# EAGLE design CncBooster_1.1 (EAGLE 7.2.0)
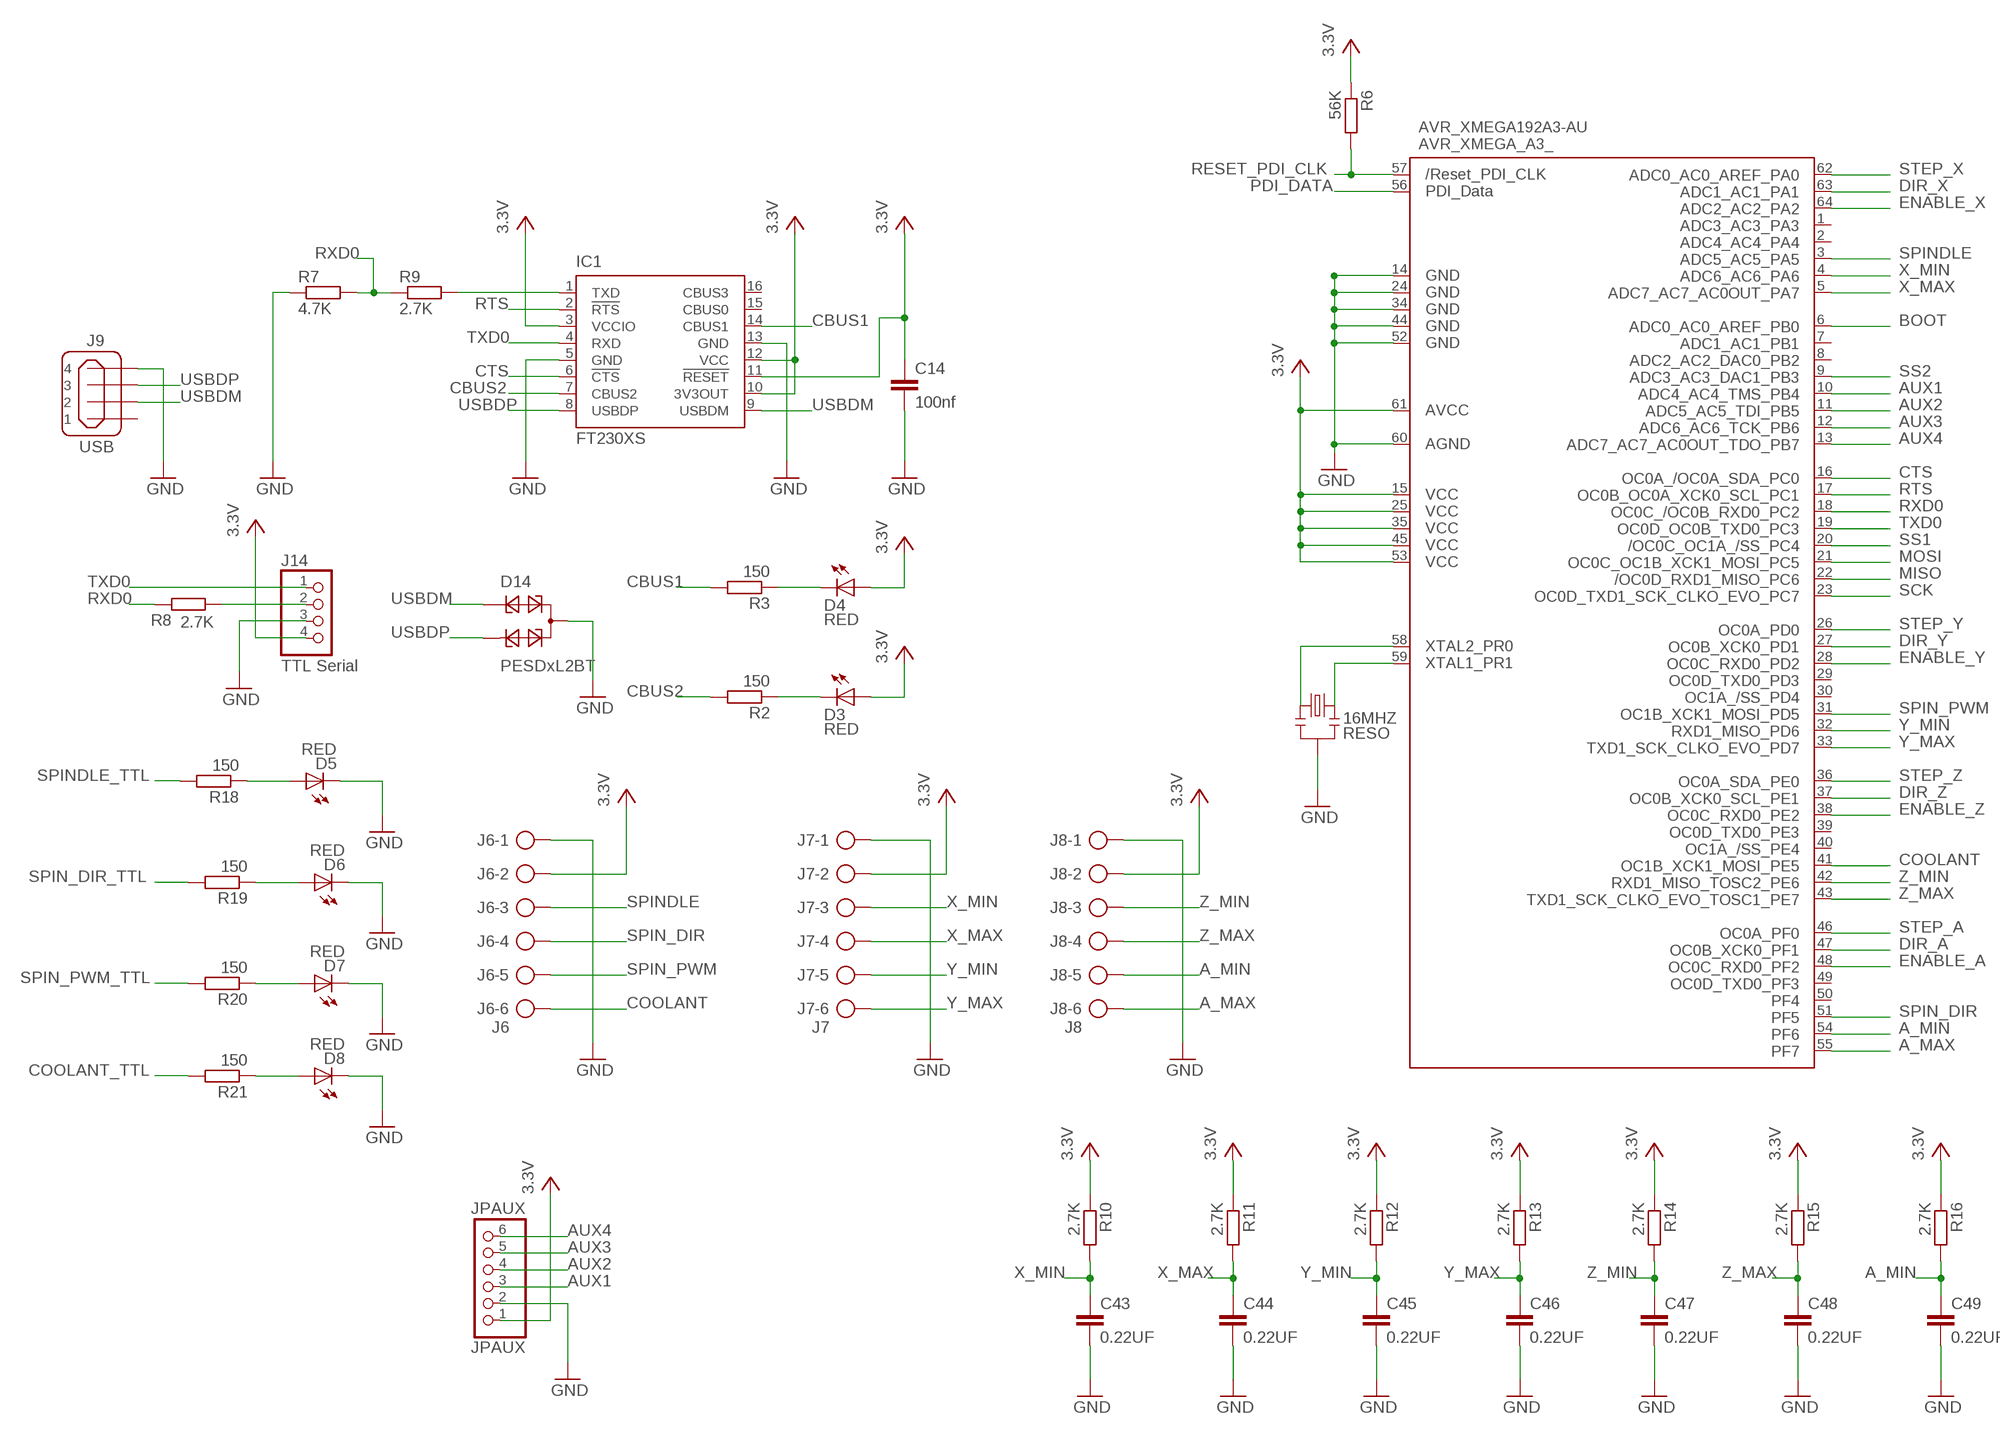
[diagram p0: schematic, sheet 1, part 1 of 2]
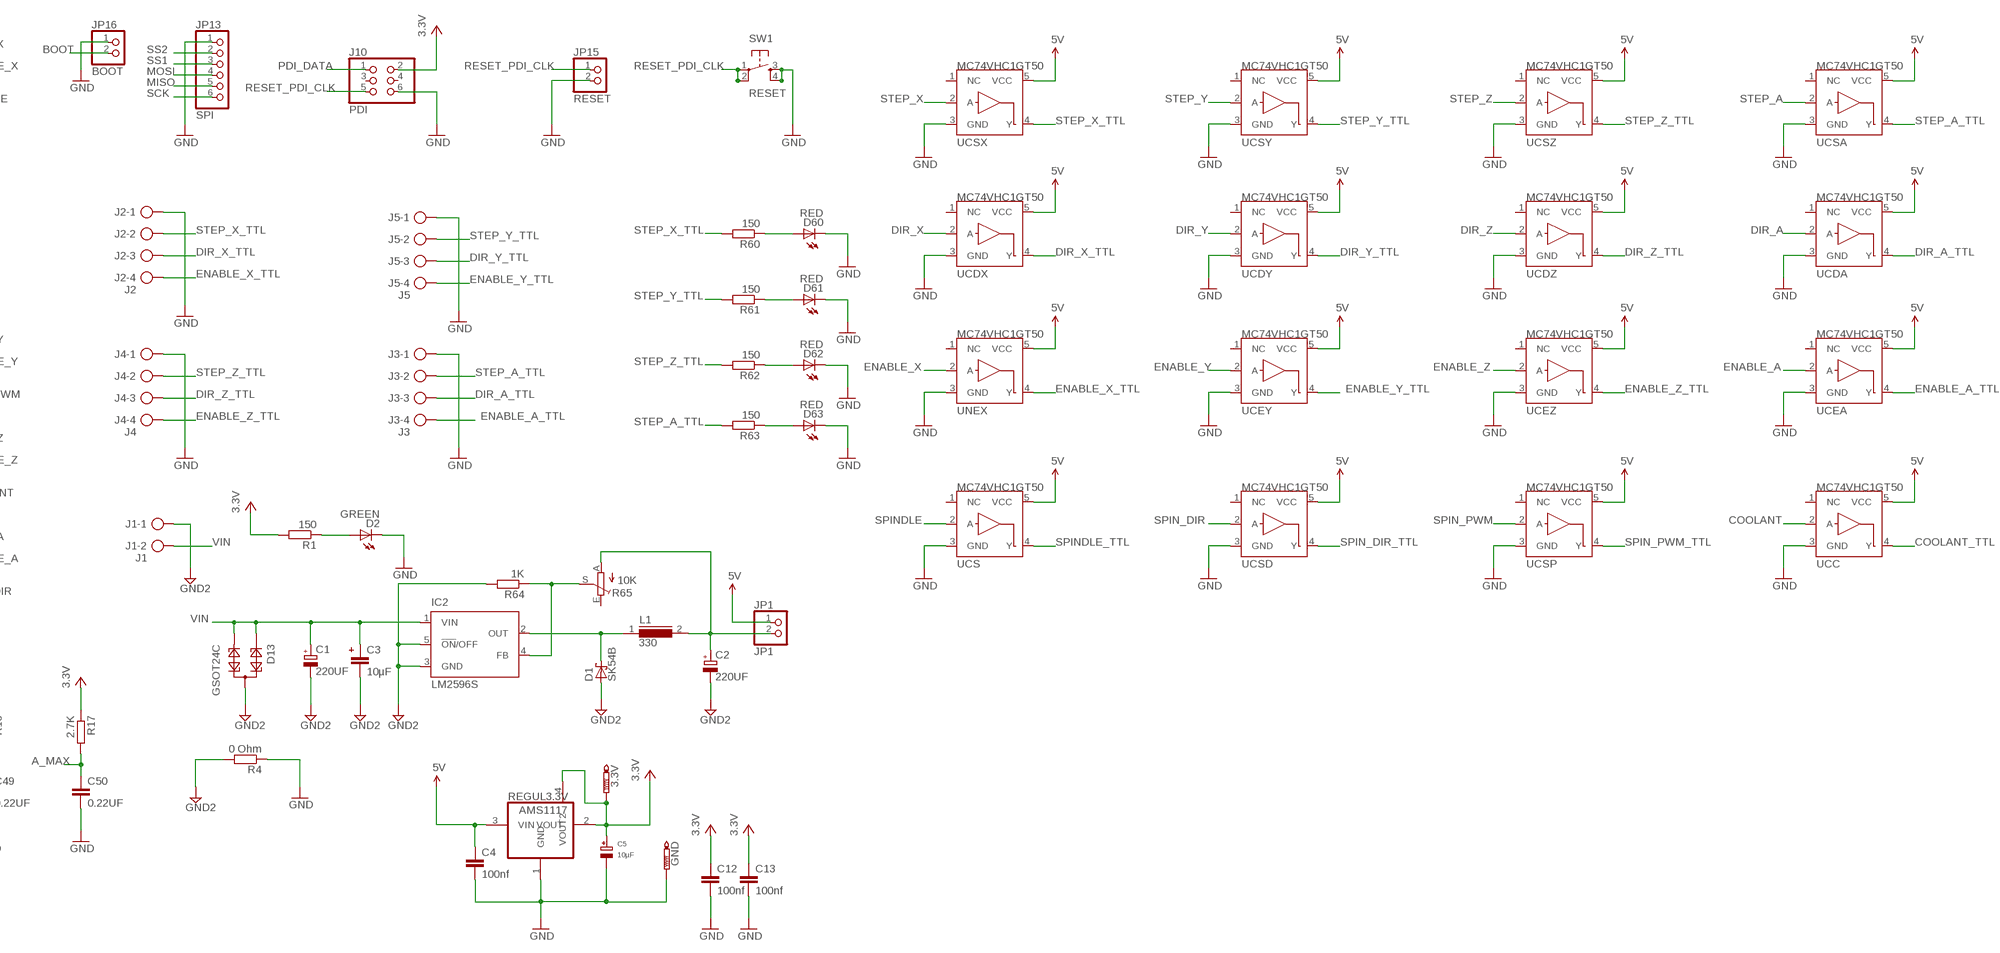
[diagram p1: schematic, sheet 1, part 2 of 2]

## Parts
3.3V  PTR1B1,27  [B1,27]
16MHZ  RESO  RESONATOR_CMS  [RESONATOR_CMS_AWSCR]
AVR_XMEGA192A3-AU  AVR_XMEGA_A3_  [TQFP64]
C1  220UF  CPOL-EUE  [PANASONIC_E]
C2  220UF  CPOL-EUE  [PANASONIC_E]
C3  10µF  CONDO_1206_POLA  [CONDO_1206]
C4  100nf  C-EUC1206  [C1206]
C5  10µF  CAP_TANTALUMA/3216_WAVE  [EIA3216-18/A-W]
C12  100nf  C-EUC1206  [C1206]
C13  100nf  C-EUC1206  [C1206]
C14  100nf  C-EUC1206  [C1206]
C43  0.22UF  C-EUC1206  [C1206]
C44  0.22UF  C-EUC1206  [C1206]
C45  0.22UF  C-EUC1206  [C1206]
C46  0.22UF  C-EUC1206  [C1206]
C47  0.22UF  C-EUC1206  [C1206]
C48  0.22UF  C-EUC1206  [C1206]
C49  0.22UF  C-EUC1206  [C1206]
C50  0.22UF  C-EUC1206  [C1206]
D1  SK54B  [DO-214AA]
D2  GREEN  LEDCHIPLED_1206  [CHIPLED_1206]
D3  RED  LEDCHIPLED_1206  [CHIPLED_1206]
D4  RED  LEDCHIPLED_1206  [CHIPLED_1206]
D5  RED  LEDCHIPLED_1206  [CHIPLED_1206]
D6  RED  LEDCHIPLED_1206  [CHIPLED_1206]
D7  RED  LEDCHIPLED_1206  [CHIPLED_1206]
D8  RED  LEDCHIPLED_1206  [CHIPLED_1206]
D13  GSOT24C  PESD1CAN  [SOT23]
D14  PESDxL2BT  PESD1CAN  [SOT23]
D60  RED  LEDCHIPLED_1206  [CHIPLED_1206]
D61  RED  LEDCHIPLED_1206  [CHIPLED_1206]
D62  RED  LEDCHIPLED_1206  [CHIPLED_1206]
D63  RED  LEDCHIPLED_1206  [CHIPLED_1206]
GND  PTR1B1,27  [B1,27]
IC1  FT230XS  [SSOP16]
IC2  LM2596S  [TO263-5]
J1  J1  AK500/2  [AK500/2]
J2  J2  AK500/4  [AK500/4]
J3  J3  AK500/4  [AK500/4]
J4  J4  AK500/4  [AK500/4]
J5  J5  AK500/4  [AK500/4]
J6  J6  AK500/6  [AK500/6]
J7  J7  AK500/6  [AK500/6]
J8  J8  AK500/6  [AK500/6]
J9  USB  MINI-USB_4P-85-32004-10X  [85-32004-10X]
J10  PDI  PINHD-2X3  [2X03]
J14  TTL Serial  PINHD-1X4  [1X04]
JP1  JP1  PINHD-1X2  [1X02]
JP13  SPI  PINHD-1X6  [1X06]
JP15  RESET  PINHD-1X2  [1X02]
JP16  BOOT  PINHD-1X2  [1X02]
JPAUX  JPAUX  PINHD-1X6  [1X06]
L1  330  DR127  [DR127]
R1  150  R-EU_R1206  [R1206]
R2  150  R-EU_R1206  [R1206]
R3  150  R-EU_R1206  [R1206]
R4  0 Ohm  R-EU_R1206  [R1206]
R6  56K  R-EU_R1206  [R1206]
R7  4.7K  R-EU_R1206  [R1206]
R8  2.7K  R-EU_R1206  [R1206]
R9  2.7K  R-EU_R1206  [R1206]
R10  2.7K  R-EU_R1206  [R1206]
R11  2.7K  R-EU_R1206  [R1206]
R12  2.7K  R-EU_R1206  [R1206]
R13  2.7K  R-EU_R1206  [R1206]
R14  2.7K  R-EU_R1206  [R1206]
R15  2.7K  R-EU_R1206  [R1206]
R16  2.7K  R-EU_R1206  [R1206]
R17  2.7K  R-EU_R1206  [R1206]
R18  150  R-EU_R1206  [R1206]
R19  150  R-EU_R1206  [R1206]
R20  150  R-EU_R1206  [R1206]
R21  150  R-EU_R1206  [R1206]
R60  150  R-EU_R1206  [R1206]
R61  150  R-EU_R1206  [R1206]
R62  150  R-EU_R1206  [R1206]
R63  150  R-EU_R1206  [R1206]
R64  1K  R-EU_R1206  [R1206]
R65  10K  TRIM_EU-S64W  [S64W]
REGUL3.3V  AMS1117  [SOT223-A]
SW1  RESET  TAC_SWITCHSMD  [TACTILE_SWITCH_SMD]
UCC  MC74VHC1GT50  [SOT23-5]
UCDA  MC74VHC1GT50  [SOT23-5]
UCDX  MC74VHC1GT50  [SOT23-5]
UCDY  MC74VHC1GT50  [SOT23-5]
UCDZ  MC74VHC1GT50  [SOT23-5]
UCEA  MC74VHC1GT50  [SOT23-5]
UCEY  MC74VHC1GT50  [SOT23-5]
UCEZ  MC74VHC1GT50  [SOT23-5]
UCS  MC74VHC1GT50  [SOT23-5]
UCSA  MC74VHC1GT50  [SOT23-5]
UCSD  MC74VHC1GT50  [SOT23-5]
UCSP  MC74VHC1GT50  [SOT23-5]
UCSX  MC74VHC1GT50  [SOT23-5]
UCSY  MC74VHC1GT50  [SOT23-5]
UCSZ  MC74VHC1GT50  [SOT23-5]
UNEX  MC74VHC1GT50  [SOT23-5]

## Nets
5V: C4.1 JP1.1 REGUL3.3V.3(VIN) UCC.5(VCC) UCDA.5(VCC) UCDX.5(VCC) UCDY.5(VCC) UCDZ.5(VCC) UCEA.5(VCC) UCEY.5(VCC) UCEZ.5(VCC) UCS.5(VCC) UCSA.5(VCC) UCSD.5(VCC) UCSP.5(VCC) UCSX.5(VCC) UCSY.5(VCC) UCSZ.5(VCC) UNEX.5(VCC)
A_MAX: AVR_XMEGA192A3-AU.55(PF7) C50.1 J8.6 R17.2
A_MIN: AVR_XMEGA192A3-AU.54(PF6) C49.1 J8.5 R16.2
AUX1: AVR_XMEGA192A3-AU.10(PB4) JPAUX.3
AUX2: AVR_XMEGA192A3-AU.11(PB5) JPAUX.4
AUX3: AVR_XMEGA192A3-AU.12(PB6) JPAUX.5
AUX4: AVR_XMEGA192A3-AU.13(PB7) JPAUX.6
BOOT: AVR_XMEGA192A3-AU.6(PB0) JP16.2
CBUS1: IC1.14(CBUS1) R3.2
CBUS2: IC1.7(CBUS2) R2.2
COOLANT: AVR_XMEGA192A3-AU.41(PE5) J6.6 UCC.2(A)
COOLANT_TTL: R21.2 UCC.4(Y)
CTS: AVR_XMEGA192A3-AU.16(PC0) IC1.6(!CTS)
DIR_A: AVR_XMEGA192A3-AU.47(PF1) UCDA.2(A)
DIR_A_TTL: J3.3 UCDA.4(Y)
DIR_X: AVR_XMEGA192A3-AU.63(PA1) UCDX.2(A)
DIR_X_TTL: J2.3 UCDX.4(Y)
DIR_Y: AVR_XMEGA192A3-AU.27(PD1) UCDY.2(A)
DIR_Y_TTL: J5.3 UCDY.4(Y)
DIR_Z: AVR_XMEGA192A3-AU.37(PE1) UCDZ.2(A)
DIR_Z_TTL: J4.3 UCDZ.4(Y)
ENABLE_A: AVR_XMEGA192A3-AU.48(PF2) UCEA.2(A)
ENABLE_A_TTL: J3.4 UCEA.4(Y)
ENABLE_X: AVR_XMEGA192A3-AU.64(PA2) UNEX.2(A)
ENABLE_X_TTL: J2.4 UNEX.4(Y)
ENABLE_Y: AVR_XMEGA192A3-AU.28(PD2) UCEY.2(A)
ENABLE_Y_TTL: J5.4 UCEY.4(Y)
ENABLE_Z: AVR_XMEGA192A3-AU.38(PE2) UCEZ.2(A)
ENABLE_Z_TTL: J4.4 UCEZ.4(Y)
GND: 16MHZ.P$3 AVR_XMEGA192A3-AU.14(GND1) AVR_XMEGA192A3-AU.24(GND2) AVR_XMEGA192A3-AU.34(GND3) AVR_XMEGA192A3-AU.44(GND4) AVR_XMEGA192A3-AU.52(GND5) AVR_XMEGA192A3-AU.60(AGND) C4.2 C5.- C12.2 C13.2 C14.2 C43.2 C44.2 C45.2 C46.2 C47.2 C48.2 C49.2 C50.2 D2.C D5.C D6.C D7.C D8.C D14.3 D60.C D61.C D62.C D63.C GND.TP IC1.5(GND) IC1.13(GND) J2.1 J3.1 J4.1 J5.1 J6.1 J7.1 J8.1 J9.4 J10.6 J14.3 JP13.1 JP15.2 JP16.1 JPAUX.2 R4.1 R7.1 REGUL3.3V.1(GND) SW1.3 SW1.4 UCC.3(GND) UCDA.3(GND) UCDX.3(GND) UCDY.3(GND) UCDZ.3(GND) UCEA.3(GND) UCEY.3(GND) UCEZ.3(GND) UCS.3(GND) UCSA.3(GND) UCSD.3(GND) UCSP.3(GND) UCSX.3(GND) UCSY.3(GND) UCSZ.3(GND) UNEX.3(GND)
GND2 [Power]: C1.- C2.- C3.1 D1.A D13.3 IC2.3(GND) IC2.5(!ON!/OFF) J1.1 R4.2 R64.2
MISO: AVR_XMEGA192A3-AU.22(PC6) JP13.5
MOSI: AVR_XMEGA192A3-AU.21(PC5) JP13.4
N$1: 16MHZ.P$2 AVR_XMEGA192A3-AU.59(PR1)
N$2: 16MHZ.P$1 AVR_XMEGA192A3-AU.58(PR0)
N$3: D3.C R2.1
N$4: D4.C R3.1
N$5: J14.2 R8.1
N$6: IC1.1(TXD) R9.2
N$7: D5.A R18.1
N$8: D6.A R19.1
N$9: D7.A R20.1
N$10: D8.A R21.1
N$11: D60.A R60.1
N$12: D61.A R61.1
N$13: D62.A R62.1
N$14: D63.A R63.1
N$15 [Power]: D1.C IC2.2(OUT) L1.1
N$16 [Power]: IC2.4(FB) R64.1 R65.S
N$17: D2.A R1.1
N$18 [Power]: C2.+ JP1.2 L1.2 R65.A
PDI_DATA: AVR_XMEGA192A3-AU.56(PDI_DATA) J10.1
RESET_PDI_CLK: AVR_XMEGA192A3-AU.57(RESET) J10.5 JP15.1 R6.2 SW1.1 SW1.2
RTS: AVR_XMEGA192A3-AU.17(PC1) IC1.2(!RTS)
RXD0: AVR_XMEGA192A3-AU.18(PC2) R7.2 R8.2 R9.1
SCK: AVR_XMEGA192A3-AU.23(PC7) JP13.6
SPIN_DIR: AVR_XMEGA192A3-AU.51(PF5) J6.4 UCSD.2(A)
SPIN_DIR_TTL: R19.2 UCSD.4(Y)
SPIN_PWM: AVR_XMEGA192A3-AU.31(PD5) J6.5 UCSP.2(A)
SPIN_PWM_TTL: R20.2 UCSP.4(Y)
SPINDLE: AVR_XMEGA192A3-AU.3(PA5) J6.3 UCS.2(A)
SPINDLE_TTL: R18.2 UCS.4(Y)
SS1: AVR_XMEGA192A3-AU.20(PC4) JP13.3
SS2: AVR_XMEGA192A3-AU.9(PB3) JP13.2
STEP_A: AVR_XMEGA192A3-AU.46(PF0) UCSA.2(A)
STEP_A_TTL: J3.2 R63.2 UCSA.4(Y)
STEP_X: AVR_XMEGA192A3-AU.62(PA0) UCSX.2(A)
STEP_X_TTL: J2.2 R60.2 UCSX.4(Y)
STEP_Y: AVR_XMEGA192A3-AU.26(PD0) UCSY.2(A)
STEP_Y_TTL: J5.2 R61.2 UCSY.4(Y)
STEP_Z: AVR_XMEGA192A3-AU.36(PE0) UCSZ.2(A)
STEP_Z_TTL: J4.2 R62.2 UCSZ.4(Y)
TXD0: AVR_XMEGA192A3-AU.19(PC3) IC1.4(RXD) J14.1
USBDM: D14.1 IC1.9(USBDM) J9.2
USBDP: D14.2 IC1.8(USBDP) J9.3
VCC: 3.3V.TP AVR_XMEGA192A3-AU.15(VCC1) AVR_XMEGA192A3-AU.25(VCC2) AVR_XMEGA192A3-AU.35(VCC3) AVR_XMEGA192A3-AU.45(VCC4) AVR_XMEGA192A3-AU.53(VCC5) AVR_XMEGA192A3-AU.61(AVCC) C5.+ C12.1 C13.1 C14.1 D3.A D4.A IC1.3(VCCIO) IC1.10(3V3OUT) IC1.11(!RESET) IC1.12(VCC) J6.2 J7.2 J8.2 J10.2 J14.4 JPAUX.1 R1.2 R6.1 R10.1 R11.1 R12.1 R13.1 R14.1 R15.1 R16.1 R17.1 REGUL3.3V.2(VOUT) REGUL3.3V.4(VOUT2) ; supply symbol labelled 3.3V
VIN [Power]: C1.+ C3.2 D13.1 D13.2 IC2.1(VIN) J1.2
X_MAX: AVR_XMEGA192A3-AU.5(PA7) C44.1 J7.4 R11.2
X_MIN: AVR_XMEGA192A3-AU.4(PA6) C43.1 J7.3 R10.2
Y_MAX: AVR_XMEGA192A3-AU.33(PD7) C46.1 J7.6 R13.2
Y_MIN: AVR_XMEGA192A3-AU.32(PD6) C45.1 J7.5 R12.2
Z_MAX: AVR_XMEGA192A3-AU.43(PE7) C48.1 J8.4 R15.2
Z_MIN: AVR_XMEGA192A3-AU.42(PE6) C47.1 J8.3 R14.2
Unconnected: AVR_XMEGA192A3-AU.1(PA3) AVR_XMEGA192A3-AU.2(PA4) AVR_XMEGA192A3-AU.7(PB1) AVR_XMEGA192A3-AU.8(PB2) AVR_XMEGA192A3-AU.29(PD3) AVR_XMEGA192A3-AU.30(PD4) AVR_XMEGA192A3-AU.39(PE3) AVR_XMEGA192A3-AU.40(PE4) AVR_XMEGA192A3-AU.49(PF3) AVR_XMEGA192A3-AU.50(PF4) IC1.15(CBUS0) IC1.16(CBUS3) J9.1 J10.3 J10.4 R65.E UCC.1(NC) UCDA.1(NC) UCDX.1(NC) UCDY.1(NC) UCDZ.1(NC) UCEA.1(NC) UCEY.1(NC) UCEZ.1(NC) UCS.1(NC) UCSA.1(NC) UCSD.1(NC) UCSP.1(NC) UCSX.1(NC) UCSY.1(NC) UCSZ.1(NC) UNEX.1(NC)

## Library data of the parts
3.3V GND = testpad:PTR1: TEST PIN
16MHZ = QuartzCeramiqueCMS:RESONATOR_CMS
AVR_XMEGA192A3-AU = xmega:AVR_XMEGA_A3_: Device for Atmel AVR XMEGA A3 Series
C1 C2 = resistor:CPOL-EU: POLARIZED CAPACITOR, European symbol
C3 = Base_CC:CONDO_1206_POLA
C4 C12-C14 C43-C50 = rcl:C-EU: CAPACITOR, European symbol
C5 = microbuilder:CAP_TANTALUM: Tantalum Capacitors Wave footprints have larger pads and are meant to be used for hand soldering. Reflow footprints are optimised for solder paste and a reflow oven. EIA3216-18/A-[R/W] - Size A / 3216-18 / 1206 footprint 4.7µF 25V 10% Tantalum Capacitor 10µF 16V 10% Tantalum Capacitor [Digikey: 495-2236-2-ND] EIA3528-21/B-[R/W] - Size B / 3528-21 47µF 10V 10% Tantalum Capactior [Digikey: 495-2216-1-ND] EIA6032-28/C-[R/W] - Size C / 6032-28 10µF 35V 20% Tantalum Capacitor [Digikey: 495-2285-1-ND] 100µF 16V 10% Tantalum Capactior [Digikey: 399-5214-1-ND]
D1 = GlowATof:SK54B
D2-D8 D60-D63 = Base_CC:LED: LED OSRAM: - CHIPLED LG R971, LG N971, LY N971, LG Q971, LY Q971, LO R971, LY R971 LH N974, LH R974 LS Q976, LO Q976, LY Q976 LO Q996 - Hyper CHIPLED LW Q18S LB Q993, LB Q99A, LB R99A - SideLED LS A670, LO A670, LY A670, LG A670, LP A670 LB A673, LV A673, LT A673, LW A673 LH A674 LY A675 LS A676, LA A676, LO A676, LY A676, LW A676 LS A679, LY A679, LG A679 - Hyper Micro SIDELED® LS Y876, LA Y876, LO Y876, LY Y876 LT Y87S - SmartLED LW L88C, LW L88S LB L89C, LB L89S, LG L890 LS L89K, LO L89K, LY L89K LS L896, LA L896, LO L896, LY L896 - TOPLED LS T670, LO T670, LY T670, LG T670, LP T670 LSG T670, LSP T670, LSY T670, LOP T670, LYG T670 LG T671, LOG T671, LSG T671 LB T673, LV T673, LT T673, LW T673 LH T674 LS T676, LA T676, LO T676, LY T676, LB T676, LH T676, LSB T676, LW T676 LB T67C, LV T67C, LT T67C, LS T67K, LO T67K, LY T67K, LW E67C LS E67B, LA E67B, LO E67B, LY E67B, LB E67C, LV E67C, LT E67C LW T67C LS T679, LY T679, LG T679 LS T770, LO T770, LY T770, LG T770, LP T770 LB T773, LV T773, LT T773, LW T773 LH T774 LS E675, LA E675, LY E675, LS T675 LS T776, LA T776, LO T776, LY T776, LB T776 LHGB T686 LT T68C, LB T68C - Hyper Mini TOPLED® LB M676 - Mini TOPLED Santana® LG M470 LS M47K, LO M47K, LY M47K Source: http://www.osram.convergy.de LUXEON: - LUMILED® LXK2-PW12-R00, LXK2-PW12-S00, LXK2-PW14-U00, LXK2-PW14-V00 LXK2-PM12-R00, LXK2-PM12-S00, LXK2-PM14-U00 LXK2-PE12-Q00, LXK2-PE12-R00, LXK2-PE12-S00, LXK2-PE14-T00, LXK2-PE14-U00 LXK2-PB12-K00, LXK2-PB12-L00, LXK2-PB12-M00, LXK2-PB14-N00, LXK2-PB14-P00, LXK2-PB14-Q00 LXK2-PR12-L00, LXK2-PR12-M00, LXK2-PR14-Q00, LXK2-PR14-R00 LXK2-PD12-Q00, LXK2-PD12-R00, LXK2-PD12-S00 LXK2-PH12-R00, LXK2-PH12-S00 LXK2-PL12-P00, LXK2-PL12-Q00, LXK2-PL12-R00 Source: www.luxeon.com KINGBRIGHT: KA-3528ASYC Source: www.kingbright.com
D13 D14 = diode:PESD1CAN: CAN bus ESD protection diode Source: http://www.nxp.com/documents/data_sheet/PESD1CAN.pdf
IC1 = ftdichip:FT230X: USB to BASIC UART IC Auto generated by make-symbol-device-package-bsdl.ulp Rev. 43 Source: Data sheet <http://www.ftdichip.com/Support/Documents/DataSheets/ICs/DS_FT230X.pdf>
IC2 = national-semiconductor:LM2596: SIMPLE SWITCHER® Power Converter 150 kHz 3A Step-Down Voltage Regulator Source: http://www.national.com/ds/LM/LM2596.pdf; MF: NATIONAL SEMICONDUCTOR; MPN: LM2596S-ADJ/NOPB; OC_FARNELL: 9494367; OC_NEWARK: 41K3842
J1 = con-ptr500:AK500/2: CONNECTOR; OC_FARNELL: unknown; OC_NEWARK: unknown
J2-J5 = con-ptr500:AK500/4: CONNECTOR; OC_FARNELL: unknown; OC_NEWARK: unknown
J6-J8 = con-ptr500:AK500/6: CONNECTOR; OC_FARNELL: unknown; OC_NEWARK: unknown
J9 = con-cypressindustries:MINI-USB_4P-: MINI USB 4 Pol. Source: www.cypressindustries.com
J10 = pinhead:PINHD-2X3: PIN HEADER
J14 = pinhead:PINHD-1X4: PIN HEADER
JP1 JP15 JP16 = pinhead:PINHD-1X2: PIN HEADER
JP13 JPAUX = pinhead:PINHD-1X6: PIN HEADER
L1 = inductors:DR127: High Power Density, High Efficiency, Shielded Inductors Source: coiltronics_dr_series.pdf
R1-R4 R6-R21 R60-R64 = Base_CC:R-EU_: RESISTOR, European symbol
R65 = pot:TRIM_EU-: POTENTIOMETER
REGUL3.3V = CC_burr-brown:AMS1117
SW1 = SparkFun:TAC_SWITCH: Momentary Switch Button commonly used for reset or general input. Spark Fun Electronics SKU : COM-00097
UCC UCDA UCDX UCDY UCDZ UCEA UCEY UCEZ UCS UCSA UCSD UCSP UCSX UCSY UCSZ UNEX = SparkFun3:MC74VHC1GT50

## Net classes
0 default: width 0.406 mm
1 Power: width 0.762 mm

## Board
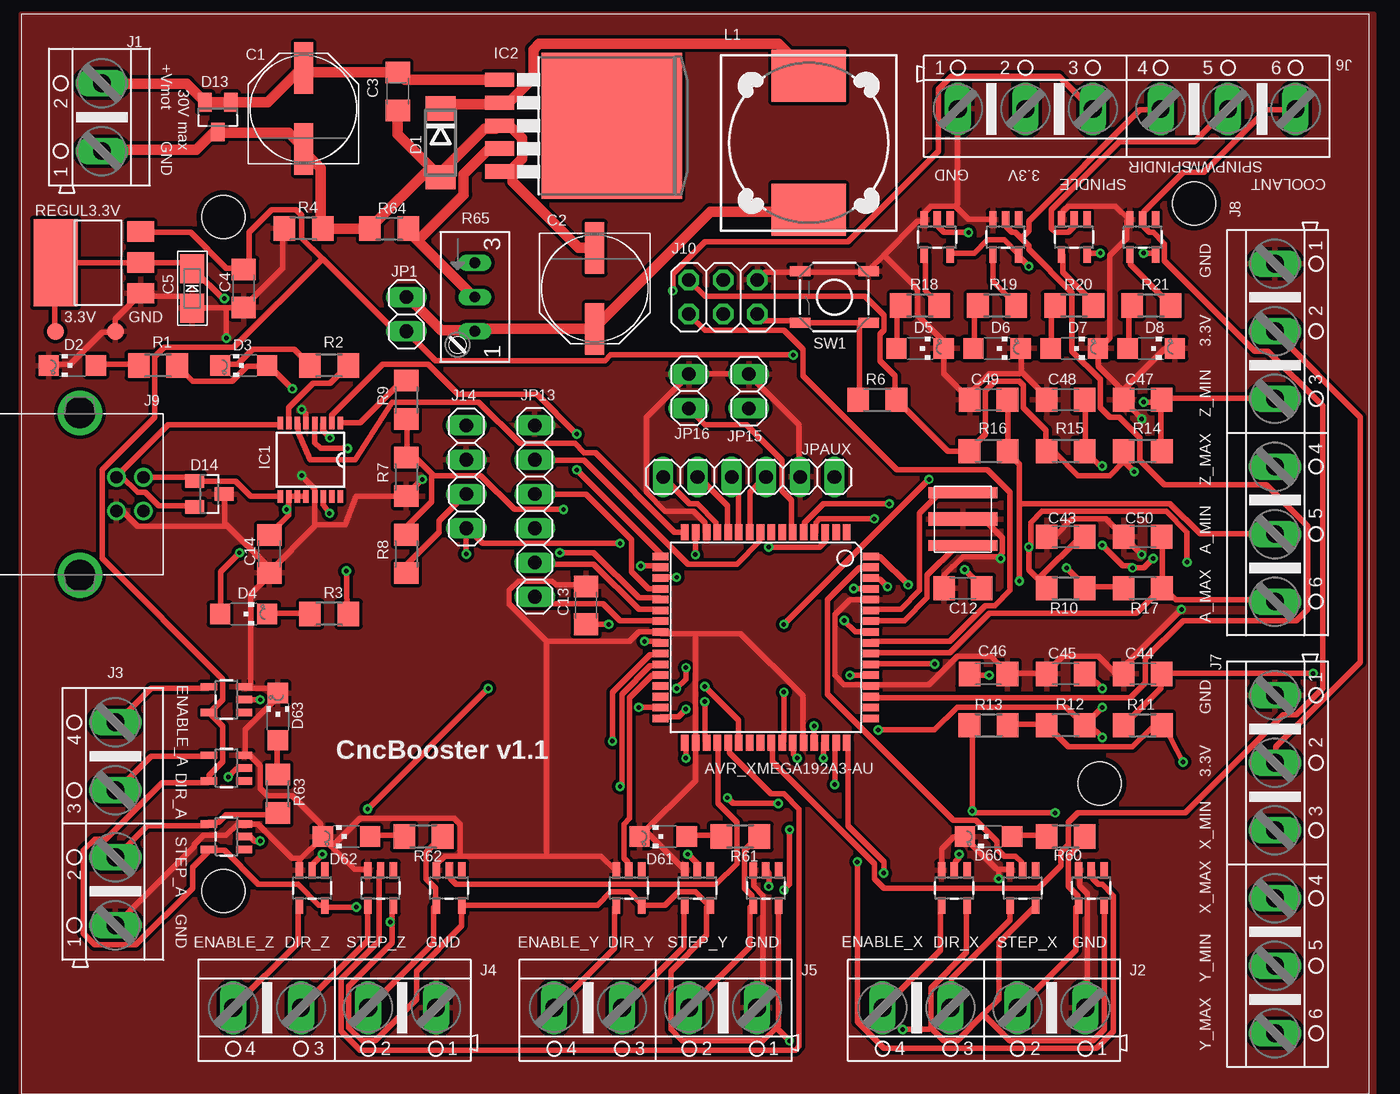
[diagram p2: board, top side]
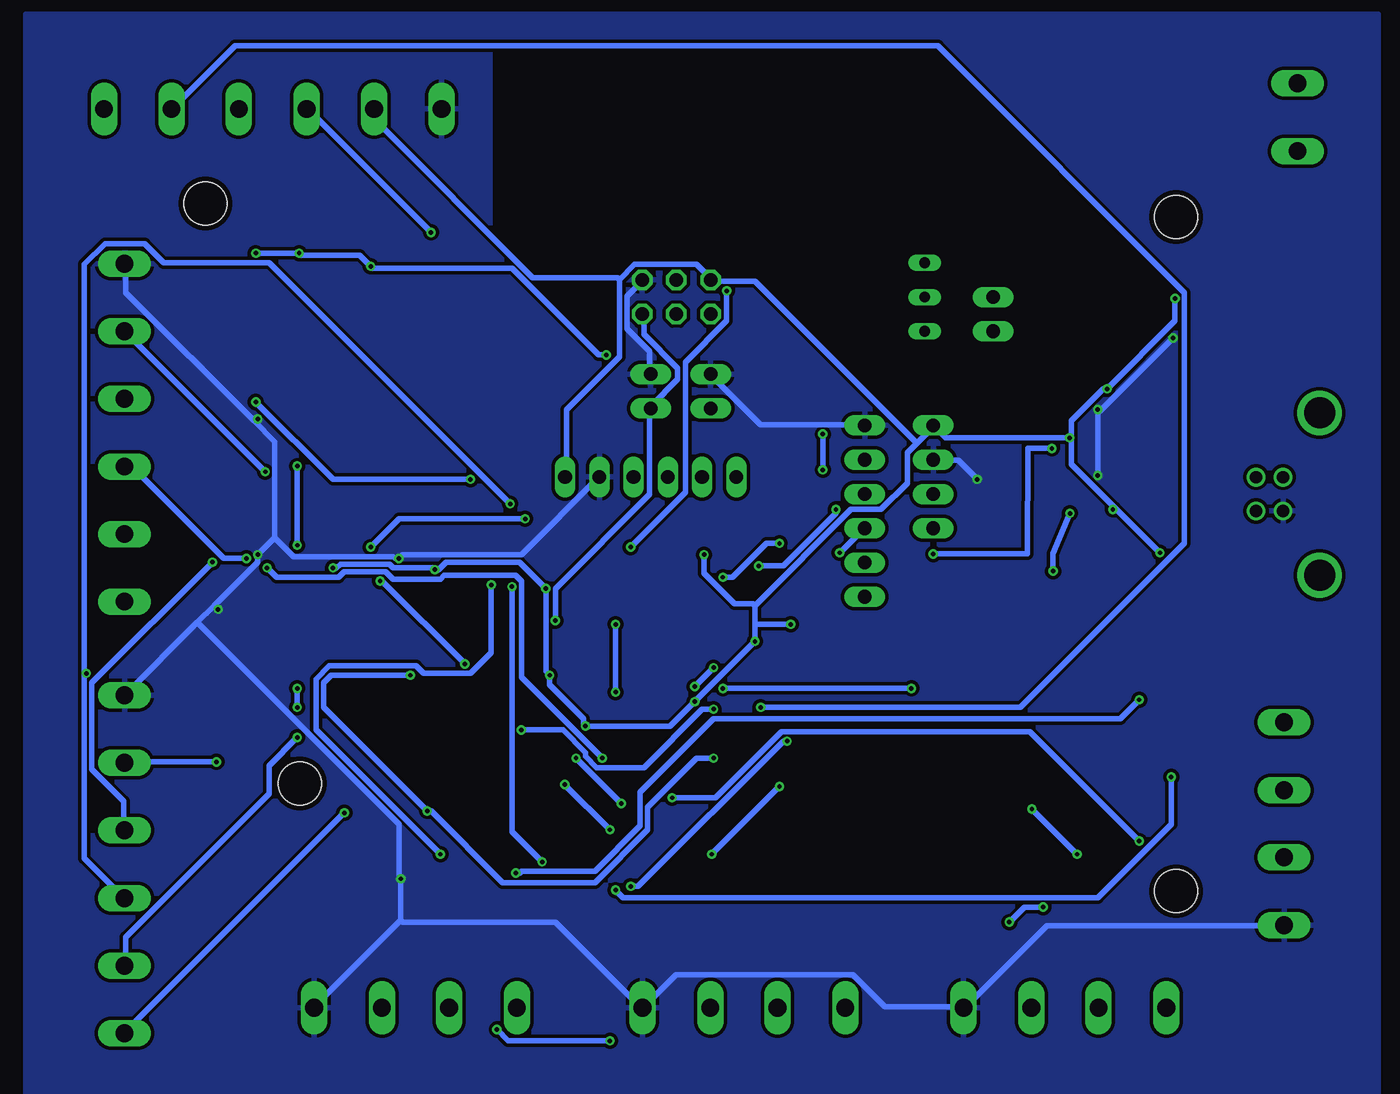
[diagram p3: board, bottom side, seen from below]

No outline drawn. Coordinates in mm, seen from the top.
Copper layers (1*16): Top 0.0356mm / dielectric 1.5011mm / Bottom 0.0356mm
Design rules "OshPark": minimum track width 6mil, minimum drill 13mil, track to track 6mil, track to pad 6mil, pad to pad 6mil, via to via 6mil, smd to smd 6mil, copper to edge 15mil, drill to drill 6mil, minimum pad ring 7mil, minimum via ring 7mil, stop-mask expansion 3mil, vias tented up to drill 0mil, thermal gap 10mil
Holes 3.2 mm at 15,15 15,65 87,66 80,23
tKeepout: area 55.2,67.3 to 61.6,73.7
bRestrict: area 52.1,63.5 to 65.4,77.5

### Footprints (pad centres in the part's own frame; a part is rotated, then mirrored left to right if it is on the bottom)
B1,27 = smd 1.27 x 1.27: TP 0,0
RESONATOR_CMS_AWSCR = smd 0.8 x 5.1: P$1 0,0; P$2 -3.9,0 | smd 1 x 5.1: P$3 -1.95,0
TQFP64 = smd 1.194 x 0.559: 1 -7.8,6; 2 -7.8,5.2; 3 -7.8,4.4; 4 -7.8,3.6; 5 -7.8,2.8; 6 -7.8,2; 7 -7.8,1.2; 8 -7.8,0.4; 9 -7.8,-0.4; 10 -7.8,-1.2; 11 -7.8,-2; 12 -7.8,-2.8; 13 -7.8,-3.6; 14 -7.8,-4.4; 15 -7.8,-5.2; 16 -7.8,-6; 33 7.8,-6; 34 7.8,-5.2; 35 7.8,-4.4; 36 7.8,-3.6; 37 7.8,-2.8; 38 7.8,-2; 39 7.8,-1.2; 40 7.8,-0.4; 41 7.8,0.4; 42 7.8,1.2; 43 7.8,2; 44 7.8,2.8; 45 7.8,3.6; 46 7.8,4.4; 47 7.8,5.2; 48 7.8,6 | smd 0.559 x 1.194: 17 -6,-7.8; 18 -5.2,-7.8; 19 -4.4,-7.8; 20 -3.6,-7.8; 21 -2.8,-7.8; 22 -2,-7.8; 23 -1.2,-7.8; 24 -0.4,-7.8; 25 0.4,-7.8; 26 1.2,-7.8; 27 2,-7.8; 28 2.8,-7.8; 29 3.6,-7.8; 30 4.4,-7.8; 31 5.2,-7.8; 32 6,-7.8; 49 6,7.8; 50 5.2,7.8; 51 4.4,7.8; 52 3.6,7.8; 53 2.8,7.8; 54 2,7.8; 55 1.2,7.8; 56 0.4,7.8; 57 -0.4,7.8; 58 -1.2,7.8; 59 -2,7.8; 60 -2.8,7.8; 61 -3.6,7.8; 62 -4.4,7.8; 63 -5.2,7.8; 64 -6,7.8
PANASONIC_E = smd 3.8 x 1.4: + 3,0; - -3,0
CONDO_1206 = smd 1.6 x 1.8: 1 -1.4,0; 2 1.4,0
C1206 = smd 1.6 x 1.8: 1 -1.4,0; 2 1.4,0
EIA3216-18/A-W = smd 2.15 x 1.8: + 1.475,0; - -1.475,0
DO-214AA = smd 1.8 x 2.2: A 5.09,2.54; C -0.01,2.54
CHIPLED_1206 = smd 1.5 x 1.5: A 0,-1.75; C 0,1.75
SOT23 = smd 1 x 1.4: 1 -0.95,-1.1; 2 0.95,-1.1; 3 0,1.1
SSOP16 = smd 0.914 x 0.406: 1 -2.718,2.223; 2 -2.718,1.587; 3 -2.718,0.953; 4 -2.718,0.318; 5 -2.718,-0.318; 6 -2.718,-0.953; 7 -2.718,-1.587; 8 -2.718,-2.223; 9 2.718,-2.223; 10 2.718,-1.587; 11 2.718,-0.953; 12 2.718,-0.318; 13 2.718,0.318; 14 2.718,0.953; 15 2.718,1.587; 16 2.718,2.223
TO263-5 = smd 1.067 x 2.159: 1 -3.404,-5.791; 2 -1.702,-5.791; 3 0,-5.791; 4 1.702,-5.791; 5 3.404,-5.791 | smd 10.8 x 10.41: 6 0,2.54
AK500/2 = drill 1.321 long: 1 -2.515,0; 2 2.515,0
AK500/4 = drill 1.321 long: 1 -7.518,0; 2 -2.489,0; 3 2.489,0; 4 7.518,0
AK500/6 = drill 1.321 long: 1 -12.522,0; 2 -7.518,0; 3 -2.515,0; 4 2.515,0; 5 7.518,0; 6 12.522,0
85-32004-10X = drill 0.92 pad 1.27: 1 4.71,-1.25; 2 4.71,1.25; 3 2.71,1.25; 4 2.71,-1.25 | drill 2.3 pad 3: M1 0,6.02; M2 0,-6.02
2X03 = drill 1.016 octagon: 1 -2.54,-1.27; 2 -2.54,1.27; 3 0,-1.27; 4 0,1.27; 5 2.54,-1.27; 6 2.54,1.27
1X04 = drill 1.016 long: 1 -3.81,0; 2 -1.27,0; 3 1.27,0; 4 3.81,0
1X02 = drill 1.016 long: 1 -1.27,0; 2 1.27,0
1X06 = drill 1.016 long: 1 -6.35,0; 2 -3.81,0; 3 -1.27,0; 4 1.27,0; 5 3.81,0; 6 6.35,0
DR127 = smd 3.85 x 5.5: 1 -4.975,0; 2 4.975,0
R1206 = smd 1.6 x 1.803: 1 -1.422,0; 2 1.422,0
S64W = drill 0.813 long: A 2.54,1.27; E -2.54,1.27; S 0,1.27
SOT223-A = smd 1.499 x 2.007: 1 -2.261,-4.42; 2 0.025,-4.42; 3 2.311,-4.42 | smd 6.452 x 3.251: 4 0,1.88
TACTILE_SWITCH_SMD = smd 1.524 x 0.762: 1 -2.54,1.905; 2 2.54,1.905; 3 -2.54,-1.905; 4 2.54,-1.905
SOT23-5 = smd 0.55 x 1.2: 1 -0.95,-1.3; 2 0,-1.3; 3 0.95,-1.3; 4 0.95,1.3; 5 -0.95,1.3

### Placement (x,y rotation side)
3.3V  2.54,56.52 0 top
16MHZ  69.85,40.64 270 top
AVR_XMEGA192A3-AU  55.24,33.82 270 top
C1  20.95,73.03 90 top
C2  42.55,59.69 270 top
C3  27.94,74.3 90 top
C4  16.51,59.69 270 top
C5  12.7,59.69 90 top
C12  69.85,37.47 180 top
C13  41.91,36.2 90 top
C14  18.41,40.01 270 top
C43  77.47,41.27 180 top
C44  83.19,31.11 180 top
C45  77.47,31.11 180 top
C46  71.75,31.11 0 top
C47  83.19,51.44 180 top
C48  77.47,51.44 180 top
C49  71.75,51.44 180 top
C50  83.19,41.27 180 top
D1  28.57,73.03 270 top
D2  3.81,53.98 90 top
D3  16.51,53.98 90 top
D4  16.51,35.56 270 top
D5  66.67,55.24 270 top
D6  72.39,55.24 270 top
D7  78.11,55.24 270 top
D8  83.82,55.24 270 top
D13  14.61,72.39 180 top
D14  13.97,44.45 270 top
D60  71.75,19.05 90 top
D61  47.62,19.05 90 top
D62  24.13,19.05 90 top
D63  19.05,27.94 0 top
GND  6.99,56.52 0 top
IC1  21.46,46.98 270 top
IC2  41.27,71.75 270 top
J1  6,72.39 90 top
J2  71.42,6.37 180 top
J3  7,20 90 top
J4  23.25,6.37 180 top
J5  47.06,6.37 180 top
J6  82,73 0 top
J7  93,17 270 top
J8  93,49 270 top
J9  4.37,44.45 0 top
J10  52.07,59.05 0 top
J14  33.02,45.72 90 top
JP1  28.57,57.78 90 top
JP13  38.1,43.18 270 top
JP15  53.98,52.07 90 top
JP16  49.53,52.07 270 top
JPAUX  53.98,45.72 180 top
L1  58.42,70.48 270 top
R1  10.16,53.98 0 top
R2  22.86,53.98 0 top
R3  22.86,35.56 0 top
R4  20.95,64.14 0 top
R6  63.5,51.44 180 top
R7  28.57,45.72 90 top
R8  28.57,40.01 90 top
R9  28.57,51.44 90 top
R10  77.47,37.47 180 top
R11  83.19,27.3 180 top
R12  77.47,27.3 0 top
R13  71.75,27.3 180 top
R14  83.19,47.62 0 top
R15  77.47,47.62 0 top
R16  71.75,47.62 0 top
R17  83.19,37.47 0 top
R18  66.67,58.42 0 top
R19  72.39,58.42 0 top
R20  78.11,58.42 0 top
R21  83.82,58.42 0 top
R60  77.47,19.05 0 top
R61  53.34,19.05 0 top
R62  29.84,19.05 0 top
R63  19.05,22.23 270 top
R64  27.3,64.14 180 top
R65  32.38,59.05 270 top
REGUL3.3V  4.45,61.59 90 top
SW1  60.33,59.05 180 top
UCC  83.19,63.5 180 top
UCDA  15.24,24.13 90 top
UCDX  74.3,15.24 180 top
UCDY  50.16,15.24 180 top
UCDZ  26.67,15.24 180 top
UCEA  15.24,29.21 90 top
UCEY  45.09,15.24 180 top
UCEZ  21.59,15.24 180 top
UCS  67.94,63.5 180 top
UCSA  15.24,19.05 90 top
UCSD  73.03,63.5 180 top
UCSP  78.11,63.5 180 top
UCSX  79.38,15.24 180 top
UCSY  55.24,15.24 180 top
UCSZ  31.75,15.24 180 top
UNEX  69.22,15.24 180 top

### Tracks (layer width: path | path; a pad name or v marks a point on that pad's centre or on a via)
5V  (via drill 0.33)
  Top 0.406: v80.05,62.31 79.07,62.31 UCSP.5 | v83.26,62.31 84.1,62.31 UCC.5 | UCS.5 69.01,62.31 70.69,62.31 71.67,63.28 72.92,63.28 73.9,62.31 UCSD.5 74.04,62.03 v74.74,61.33 | REGUL3.3V.3 8.94,63.84 12.57,63.84 15.23,61.19 16.48,61.19 C4.1 16.62,61.33 16.9,61.61 16.9,63.84 18.58,65.52 20.4,65.52 20.82,65.1 20.82,63.42 22.35,61.89 | 22.35,61.89 27.66,56.58 28.5,56.58 JP1.1 28.64,56.44 30.73,54.34 43.31,54.34 43.73,54.76 v57.28,54.76 | 67.47,4.89 67.47,7.82 70.13,10.48 70.13,13.83 UNEX.5 | 67.47,4.89 68.45,3.91 69.43,3.91 71.39,5.87 | 71.39,5.87 72.5,6.99 72.5,11.18 75.16,13.83 UCDX.5 | 71.39,5.87 73.34,3.91 79.49,3.91 80.33,4.75 80.33,13.83 UCSX.5 | 27.52,12.71 27.52,11.18 24.31,7.96 24.31,4.89 25.29,3.91 26.26,3.91 29.34,6.99 29.34,9.08 32.69,12.43 32.69,13.83 UCSZ.5 32.83,13.97 42.75,13.97 43.73,14.95 45.12,14.95 45.96,14.11 UCEY.5 46.1,13.97 47.78,13.97 48.76,14.95 50.01,14.95 50.99,13.97 UCDY.5 50.85,13.83 50.85,11.73 48.2,9.08 48.2,4.75 49.03,3.91 55.04,3.91 56.02,4.89 | 27.52,12.71 27.52,13.83 UCDZ.5 | 56.02,4.89 56.16,5.03 56.16,13.83 UCSY.5 | v65.38,4.75 67.33,4.75 67.47,4.89 | 56.02,4.89 v57,3.91 | v24.87,13.83 22.63,13.83 UCEZ.5 22.49,13.97 22.07,13.97 20.54,15.51 17.6,15.51 15.09,18.02 13.97,18.02 UCSA.5 13.83,17.88 12.71,16.76 12.71,15.23 8.52,11.04 5.45,11.04 4.61,11.87 4.61,18.02 5.45,18.86 6.29,18.86 10.48,23.05 13.83,23.05 UCDA.5 13.97,23.19 13.97,23.61 14.95,24.59 14.95,27.24 13.97,28.22 UCEA.5 14.11,28.36 14.95,29.2 14.95,30.73 6.01,39.67 6.01,46.24 9.92,50.15 9.92,54.62 10.62,55.32 15.79,55.32 22.35,61.89 | v27.38,12.71 27.52,12.71
  Bottom 0.406: v83.26,62.31 v80.05,62.31 79.91,62.17 75.58,62.17 v74.74,61.33 74.6,61.19 64.26,61.19 57.84,54.76 v57.28,54.76 | v65.38,4.75 64.54,3.91 v57,3.91 | v24.87,13.83 26.26,13.83 v27.38,12.71
A_MAX
  Top 0.406: AVR_XMEGA192A3-AU.55 63.14,32.69 68.87,32.69 71.81,35.62 82.7,35.62 84.52,37.44 R17.2 | C50.1 84.66,41.21 84.66,37.58 R17.2 | J8.6 92.9,36.6 85.64,36.6 84.8,37.44 R17.2
A_MIN  (via drill 0.33)
  Top 0.406: v67.75,31.85 63.14,31.85 AVR_XMEGA192A3-AU.54 | 74.04,43.73 74.04,46.66 73.2,47.5 R16.2 73.2,47.78 73.2,51.41 C49.1 | 74.04,43.73 v74.04,38 | 74.04,43.73 85.22,43.73 87.45,41.49 92.9,41.49 J8.5
  Bottom 0.406: v67.75,31.85 73.9,38 v74.04,38
AUX1
  Top 0.406: AVR_XMEGA192A3-AU.10 54.06,41.63 54.06,44.56 55.18,45.68 JPAUX.3
AUX2
  Top 0.406: AVR_XMEGA192A3-AU.11 53.23,41.63 53.23,45.26 52.81,45.68 JPAUX.4
AUX3
  Top 0.406: AVR_XMEGA192A3-AU.12 52.39,41.63 52.39,43.59 50.29,45.68 JPAUX.5
AUX4
  Top 0.406: AVR_XMEGA192A3-AU.13 51.55,41.63 51.55,42.33 50.15,43.73 49.59,43.73 47.64,45.68 JPAUX.6
BOOT
  Top 0.406: AVR_XMEGA192A3-AU.6 57.14,41.63 57.14,44.01 56.44,44.7 56.44,46.94 53.78,49.59 50.71,49.59 49.59,50.71 JP16.2
CBUS1  (via drill 0.33)
  Top 0.406: 24.13,35.56 R3.2 24.13,36.83 v24.13,38.73 | IC1.14 22.41,43.65 v22.88,43.02
  Bottom 0.406: v22.88,43.02 24.13,40.01 v24.13,38.73
CBUS2
  Top 0.406: IC1.7 19.84,49.73 19.84,50.85 21.65,52.67 22.91,52.67 24.17,53.92 R2.2
COOLANT
  Top 0.406: AVR_XMEGA192A3-AU.41 55.74,25.98 55.74,24.59 63.28,17.04 63.28,15.93 63.98,15.23 75.44,15.23 77.11,16.9 77.11,17.88 77.67,18.44 77.67,20.12 78.37,20.82 86.33,20.82 93.6,28.08 94.58,28.08 96.53,30.04 96.53,50.99 92.48,55.04 91.5,55.04 84.8,61.75 84.8,63.01 83.96,63.84 83.68,63.84 83.26,64.26 83.26,64.68 UCC.2 83.26,64.96 83.26,65.38 86.19,68.31 87.73,68.31 92.34,72.92 94.44,72.92 J6.6
COOLANT_TTL
  Top 0.406: UCC.4 82.28,62.17 82.28,61.47 85.22,58.53 R21.2
CTS
  Top 0.406: IC1.6 20.54,49.59 20.54,49.03 21.45,46.99 24.78,46.98 27.52,51.27 33.95,51.27 37.02,48.2 41.07,48.2 41.77,47.5 42.61,47.5 48.48,41.63 49.17,41.63 AVR_XMEGA192A3-AU.16
DIR_A  (via drill 0.33)
  Top 0.406: v60.35,22.91 60.35,25.98 AVR_XMEGA192A3-AU.47 | v57,19.56 57,15.51 v56.58,15.09 | v15.37,23.47 15.93,24.03 16.48,24.03 UCDA.2
  Bottom 0.406: v57,19.56 v60.35,22.91 | v56.58,15.09 56.02,14.53 20.82,14.53 15.37,19.98 v15.37,23.47
DIR_A_TTL
  Top 0.406: UCDA.4 13.83,25.01 9.64,25.01 7.12,22.49 J3.3
DIR_X
  Top 0.406: AVR_XMEGA192A3-AU.63 63.01,38.98 62.17,38.98 59.79,36.6 59.79,29.62 69.15,20.26 70.83,20.26 72.36,18.72 72.36,18.16 72.92,17.6 73.76,17.6 74.18,17.18 74.18,16.62 UCDX.2
DIR_X_TTL
  Top 0.406: UCDX.4 73.34,13.83 73.34,12.85 69.01,8.52 69.01,6.43 J2.3
DIR_Y  (via drill 0.33)
  Top 0.406: v44.42,22.77 44.56,22.91 44.56,29.62 46.66,31.71 47.36,31.71 AVR_XMEGA192A3-AU.27 | v49.45,17.74 50.15,17.04 50.15,16.62 UCDY.2
  Bottom 0.406: v49.45,17.74 v44.42,22.77
DIR_Y_TTL
  Top 0.406: UCDY.4 49.17,13.83 49.17,10.9 44.7,6.43 J5.3
DIR_Z
  Top 0.406: AVR_XMEGA192A3-AU.37 52.53,25.98 52.53,25.29 55.6,22.21 56.58,22.21 57.7,21.09 57.7,3.49 57.42,3.21 25.15,3.21 23.75,4.61 23.75,8.52 26.54,11.32 26.54,16.48 UCDZ.2
DIR_Z_TTL
  Top 0.406: UCDZ.4 25.7,13.83 25.7,11.32 20.82,6.43 J4.3
ENABLE_A  (via drill 0.33)
  Top 0.406: v63.98,16.34 63.98,17.18 61.33,19.84 61.33,25.98 AVR_XMEGA192A3-AU.48 | v17.74,29.2 16.62,29.2 UCEA.2
  Bottom 0.406: v63.98,16.34 63.7,16.34 63.56,16.48 58.12,16.48 54.76,19.84 54.76,22.35 49.31,27.8 19.14,27.8 v17.74,29.2
ENABLE_A_TTL
  Top 0.406: UCEA.4 13.83,30.04 9.64,30.04 7.12,27.52 J3.4
ENABLE_X  (via drill 0.33)
  Top 0.406: v65.8,37.72 63.7,39.81 63.14,39.81 AVR_XMEGA192A3-AU.64 | v69.57,17.74 69.57,17.46 69.29,17.18 69.29,16.62 UNEX.2
  Bottom 0.406: v65.8,37.72 65.8,32.69 67.33,31.15 70.83,31.15 71.39,31.71 77.81,31.71 78.79,30.73 78.79,26.96 v69.57,17.74
ENABLE_X_TTL
  Top 0.406: UNEX.4 68.17,13.83 68.17,10.62 63.98,6.43 J2.4
ENABLE_Y
  Top 0.406: AVR_XMEGA192A3-AU.28 47.36,31.01 46.8,31.01 45.12,29.34 45.12,20.4 44.7,19.98 44.7,17.46 44.98,17.18 44.98,16.62 UCEY.2
ENABLE_Y_TTL
  Top 0.406: UCEY.4 44.01,13.83 44.01,10.76 39.67,6.43 J5.4
ENABLE_Z  (via drill 0.33)
  Top 0.406: v50.71,30.18 53.23,27.66 53.23,26.12 AVR_XMEGA192A3-AU.38 | v49.31,31.57 49.31,30.73 v48.62,30.04 | v25.7,21.09 v34.65,30.04 | v22.35,17.74 21.65,17.04 21.65,16.62 UCEZ.2
  Bottom 0.406: v49.31,31.57 v50.71,30.18 | v34.65,30.04 v48.62,30.04 | v22.35,17.74 v25.7,21.09
ENABLE_Z_TTL
  Top 0.406: UCEZ.4 20.54,13.83 20.54,11.18 15.79,6.43 J4.4
GND  (via drill 0.33)
  Top 0.406: D2.C 2.1,54.06 3.63,54.06 6.01,56.44 6.84,56.44 GND.TP 6.99,57.42 8.8,59.23 REGUL3.3V.1 8.94,59.09 11.87,59.09 12.57,58.4 C5.- 12.71,58.26 15.23,58.26 | 15.23,58.26 16.48,58.26 C4.2 16.62,58.4 19.42,61.19 19.42,64.12 R4.1 | 21.79,42.18 21.79,42.05 18.44,38.7 C14.2 | 21.79,42.18 21.79,44.15 IC1.13 21.79,44.42 21.79,44.84 v20.82,45.82 | v20.82,50.71 21.09,50.43 21.09,49.73 IC1.5 | 15.23,42.19 18.44,38.98 C14.2 | 15.23,42.19 15.09,42.33 15.09,44.42 D14.3 | 21.79,42.18 24.03,42.18 24.87,44.28 28.5,44.28 R7.1 28.64,44.42 v29.76,45.54 | J9.4 7.12,43.17 7.54,43.17 8.66,42.05 15.09,42.05 15.23,42.19 | C14.2 18.44,38.42 17.04,37.02 17.04,30.18 UCEA.3 16.62,30.04 18.58,30.04 18.86,29.76 D63.C 19,29.62 19,29.34 16.62,26.96 16.62,25.15 UCDA.3 16.76,25.01 17.04,25.01 17.74,24.31 17.74,22.63 18.3,22.07 20.12,22.07 22.21,19.98 22.21,19.14 D62.C | v15.23,56.02 15.23,58.26 | UCDY.3 49.17,16.62 46.38,19.42 D61.C 45.96,19.14 50.01,23.19 50.01,25.98 AVR_XMEGA192A3-AU.34 50.01,26.12 50.01,34.09 | 50.01,34.09 47.5,34.09 AVR_XMEGA192A3-AU.24 47.36,34.23 45.82,34.23 45.12,33.53 38.98,33.53 | 50.01,34.09 53.37,34.09 57.98,29.48 57.98,26.12 AVR_XMEGA192A3-AU.44 | 38.98,33.53 36.18,36.32 36.18,37.3 36.88,38 39.4,38 39.67,37.72 41.91,37.72 C13.2 | 38.98,17.6 43.03,17.6 44.01,16.62 UCEY.3 | 38.98,17.6 32.55,17.6 | 32.55,17.6 31.43,17.6 30.87,17.04 30.87,16.62 UCSZ.3 | 20.68,17.32 20.68,16.62 UCEZ.3 | 20.68,17.32 22.35,19 D62.C | 23.05,18.3 22.49,18.86 D62.C | 23.05,18.3 24.73,16.62 25.7,16.62 UCDZ.3 | 20.68,17.32 20.54,17.46 20.12,17.46 17.6,19.98 16.62,19.98 UCSA.3 16.34,19.98 16.07,19.98 15.23,19.14 13.55,19.14 12.85,18.44 12.85,18.3 7.12,12.57 J3.1
  Top 0.406: 32.55,17.6 32.55,19.98 32.13,20.4 25.15,20.4 23.05,18.3 | 38.98,17.6 38.98,33.53 | AVR_XMEGA192A3-AU.14 50.71,41.63 50.71,42.33 49.87,43.17 47.78,43.17 46.38,44.56 46.38,50.15 49.45,53.23 JP16.1 49.59,53.37 53.92,53.37 JP15.2 54.06,53.23 57.7,49.59 57.7,45.82 JPAUX.2 | 74.18,53.51 74.18,55.18 D6.C | 74.18,53.51 76.14,51.55 C48.2 | 74.18,53.51 74.04,53.37 71.81,53.37 70.27,51.83 C49.2 70.27,51.55 68.45,53.37 68.45,55.18 D5.C 68.31,55.32 68.31,55.88 66.5,57.7 66.5,59.65 63.98,62.17 | J10.6 54.62,60.35 55.18,60.91 57.7,60.91 SW1.4 57.98,60.91 62.73,60.91 SW1.3 62.87,61.05 63.98,62.17 | 63.98,62.17 66.5,64.68 66.92,64.68 UCS.3 67.06,64.96 67.06,65.38 67.47,65.8 69.29,65.8 | 69.29,65.8 70.27,64.82 71.94,64.82 UCSD.3 | J6.1 69.43,72.92 69.43,65.94 69.29,65.8 | UNEX.3 68.31,16.62 68.31,18.16 69.15,19 69.99,19 D60.C 70.13,18.86 72.36,16.62 72.5,16.62 | 72.5,16.62 73.34,16.62 UCDX.3 | UCSX.3 78.51,16.48 78.51,15.37 79.07,14.81 79.07,6.43 J2.1 | v72.5,15.93 72.5,16.62 | UCSY.3 54.34,16.48 54.34,15.37 55.04,14.67 55.04,6.84 54.62,6.43 J5.1 | AVR_XMEGA192A3-AU.60 63.01,36.6 61.47,36.6 60.35,35.48 60.35,31.01 61.05,30.32 63.01,30.32 AVR_XMEGA192A3-AU.52 63.14,30.32 67.33,30.32 69.43,32.41 71.94,32.41 73.06,31.29 C46.2 73.2,31.15 76,31.15 C45.2 76.14,31.29 77.25,32.41 79.91,32.41 81.17,31.15 81.72,31.15 C44.2 81.86,31.29 81.86,31.71 v86.06,35.9 | UCSP.3 77.25,64.82 77.25,65.38 77.67,65.8 81.17,65.8 82.14,64.82 UCC.3 82,64.68 82,63.42 80.75,62.17 80.75,56.02 80.05,55.32 D7.C 79.91,55.18 79.91,53.92 81.72,52.11 81.72,51.55 C47.2 | D8.C 85.5,55.18 84.8,55.18 81.86,52.25 C47.2
  Top 0.406: 72.5,39.81 69.85,39.81 68.45,38.42 68.45,37.58 C12.2 | 72.5,39.81 72.78,40.09 72.78,41.21 71.53,42.47 69.85,42.47 16MHZ.P$3 | C43.2 76.14,41.35 76.69,41.35 77.95,42.61 80.47,42.61 81.72,41.35 C50.2 81.86,41.21 v83.12,39.95 | v72.64,39.67 72.5,39.81 | v83.12,50.01 81.86,51.27 C47.2
  Bottom 0.406: v20.82,45.82 v20.82,50.71 20.68,50.57 v15.23,56.02 | v29.76,45.54 31.15,46.94 32.97,46.94 J14.3 | JP13.1 38.14,49.59 45.82,49.59 49.45,53.23 JP16.1 | JP15.2 54.06,53.37 54.06,55.04 55.74,56.72 55.74,59.09 54.62,60.21 J10.6 | 72.5,12.85 v72.5,15.93 72.64,16.07 72.64,19.98 87.59,34.92 | 72.5,12.85 78.93,6.43 J2.1 | 72.5,12.85 72.36,12.71 61.05,12.71 54.76,6.43 J5.1 54.48,6.43 52.11,8.8 38.98,8.8 36.6,6.43 30.87,6.43 J4.1 30.59,6.43 24.59,12.43 7.12,12.43 J3.1 | 87.59,34.92 92.9,29.62 J7.1 | 87.59,34.92 86.33,36.18 | 86.33,36.18 83.12,39.4 v83.12,39.95 81.86,41.21 | 83.4,49.87 81.86,48.34 81.86,41.21 | 83.4,49.87 92.9,59.37 92.9,61.47 J8.1 | 81.86,41.21 80.47,39.81 73.06,39.81 72.92,39.67 v72.64,39.67 72.36,39.95 63.56,39.95 57.84,45.68 JPAUX.2 | v83.12,50.01 83.26,50.01 83.4,49.87 | v86.06,35.9 86.33,36.18
  pour Bottom (isolate 0.254): 0,0 100.33,0 100.33,80.01 0,80.01
  pour Top (isolate 0.254): 0,0 100.33,0 100.33,80.01 0,80.01
GND2
  Top 0.762: C3.1 27.94,71.11 31.01,68.03 D1.A | D1.A 31.15,68.31 34.37,71.53 35.2,71.53 IC2.3 35.48,71.67 36.32,71.67 37.16,70.83 37.16,69.29 36.32,68.45 35.48,68.45 IC2.5 36.46,68.17 36.46,67.61 41.35,62.73 42.47,62.73 C2.- | J1.1 6.01,69.99 12.99,69.99 14.25,71.25 D13.3 14.67,71.25 19.84,71.25 20.95,70.13 C1.- 21.09,69.71 22.21,68.59 22.21,64.4 R4.2 22.49,64.12 25.84,64.12 R64.2 26.12,64.4 30.18,68.45 D1.A
MISO
  Top 0.406: AVR_XMEGA192A3-AU.22 47.36,35.9 45.82,35.9 42.47,39.26 38.14,39.26 JP13.5
MOSI  (via drill 0.33)
  Top 0.406: v39.95,40.09 42.47,40.09 45.82,36.74 47.36,36.74 AVR_XMEGA192A3-AU.21
  Bottom 0.406: v39.95,40.09 38.14,41.91 JP13.4
N$1
  Top 0.406: AVR_XMEGA192A3-AU.59 63.14,35.9 65.24,35.9 66.64,37.3 66.64,43.03 68.03,44.42 69.85,44.42 16MHZ.P$2
N$2
  Top 0.406: AVR_XMEGA192A3-AU.58 63.14,35.06 65.52,35.06 67.2,36.74 67.2,38.42 69.29,40.51 69.85,40.51 16MHZ.P$1
N$3
  Top 0.406: D3.C 14.81,54.06 16.07,54.06 17.18,55.18 20.26,55.18 21.37,54.06 R2.1
N$4
  Top 0.406: D4.C 18.3,35.62 21.37,35.62 R3.1
N$5
  Top 0.406: R8.1 28.64,38.7 28.64,39.26 31.01,41.63 31.01,42.47 32.97,44.42 J14.2
N$6
  Top 0.406: IC1.1 23.75,49.73 25.15,49.73 28.22,52.81 28.5,52.81 R9.2
N$7
  Top 0.406: D5.A 64.96,55.32 64.96,58.12 65.24,58.4 R18.1
N$8
  Top 0.406: D6.A 70.69,55.32 70.69,58.12 70.97,58.4 R19.1
N$9
  Top 0.406: D7.A 76.42,55.32 76.42,58.26 76.56,58.4 R20.1
N$10
  Top 0.406: D8.A 82.14,55.32 82.14,58.26 82.28,58.4 R21.1
N$11
  Top 0.406: D60.A 73.62,19.14 76,19.14 R60.1
N$12
  Top 0.406: D61.A 49.45,19.14 51.83,19.14 R61.1
N$13
  Top 0.406: D62.A 25.98,19.14 28.36,19.14 R62.1
N$14
  Top 0.406: D63.A 19,26.12 19,23.75 R63.1
N$15
  Top 0.762: D1.C 31.15,73.06 31.43,73.34 35.48,73.34 IC2.2 35.76,73.62 36.32,73.62 38,75.3 38,77.39 38.42,77.81 56.16,77.81 58.4,75.58 L1.1
N$16
  Top 0.762: 29.41,63.21 33.53,59.09 R65.S | 29.41,63.21 28.78,63.84 28.78,64.12 R64.1 | 29.41,63.21 32.83,66.64 32.83,68.17 34.65,69.99 35.48,69.99 IC2.4
N$17
  Top 0.406: D2.A 5.59,54.06 8.66,54.06 R1.1
N$18
  Top 0.762: JP1.2 28.64,59.09 31.15,56.58 33.53,56.58 R65.A 33.95,56.72 42.47,56.72 C2.+ 42.75,57 51.13,65.38 58.4,65.38 L1.2
PDI_DATA
  Top 0.406: AVR_XMEGA192A3-AU.56 63.14,33.53 68.87,33.53 71.53,36.18 72.22,36.18 73.34,37.3 73.34,44.56 71.67,46.24 64.96,46.24 57.98,53.23 57.98,55.18 56.58,56.58 50.71,56.58 49.59,57.7 J10.1
RESET_PDI_CLK  (via drill 0.33)
  Top 0.406: J10.5 54.62,57.7 55.04,57.28 57.7,57.28 SW1.2 57.98,57.14 62.87,57.14 SW1.1 62.17,57 62.17,51.55 R6.2 | v61.05,35.06 61.89,34.23 63.01,34.23 AVR_XMEGA192A3-AU.57
  Bottom 0.406: v61.05,35.06 61.05,37.44 54.06,44.42 54.06,50.71 JP15.1 53.92,50.99 51.97,52.95 51.97,53.78 54.48,56.3 54.48,57.7 J10.5
RTS  (via drill 0.33)
  Top 0.406: v41.21,48.9 38.28,51.83 32.41,51.83 30.18,54.06 26.82,54.06 23.05,50.29 23.05,49.73 IC1.2 | v41.21,46.24 47.5,39.95 AVR_XMEGA192A3-AU.17
  Bottom 0.406: v41.21,46.24 v41.21,48.9
RXD0  (via drill 0.33)
  Top 0.406: v45.96,39.12 47.36,39.12 AVR_XMEGA192A3-AU.18 | v40.23,43.31 36.6,43.31 34.09,45.82 30.59,45.82 | 30.59,45.82 29.34,47.08 28.64,47.08 R7.2 28.64,47.22 28.64,50.01 R9.1 | R8.2 28.64,41.49 28.64,42.05 30.45,43.87 30.45,45.68 30.59,45.82
  Bottom 0.406: v45.96,39.12 44.15,39.12 40.23,43.03 v40.23,43.31
SCK
  Top 0.406: AVR_XMEGA192A3-AU.23 47.36,35.06 44.42,35.06 43.17,36.32 38.56,36.32 38.14,36.74 JP13.6
SPIN_DIR
  Top 0.406: 74.18,63.42 73.76,63.84 73.48,63.84 73.06,64.26 73.06,64.68 UCSD.2 | 74.18,63.42 74.74,62.87 74.74,62.59 77.95,59.37 77.95,55.04 80.05,52.95 80.05,50.85 80.75,50.15 81.44,50.15 82.98,48.62 82.98,46.94 84.8,45.12 92.34,45.12 95.42,42.05 95.42,35.9 94.58,35.06 86.19,35.06 83.4,32.27 83.4,30.45 82.28,29.34 63.14,29.34 AVR_XMEGA192A3-AU.51 | 74.18,63.42 74.74,63.98 74.74,64.68 82.98,72.92 84.38,72.92 J6.4
SPIN_DIR_TTL
  Top 0.406: UCSD.4 72.08,62.17 72.08,60.21 73.76,58.53 R19.2
SPIN_PWM  (via drill 0.33)
  Top 0.406: v45.82,28.64 47.36,28.64 AVR_XMEGA192A3-AU.31 | UCSP.2 78.09,64.68 78.09,64.26 77.67,63.84 76.69,63.84 76.42,64.12 76.42,65.52 81.44,70.55 87.03,70.55 89.41,72.92 J6.5
  Bottom 0.406: v45.82,28.64 26.54,28.64 14.39,40.79 14.39,59.37 32.69,77.67 84.8,77.67 89.41,73.06 J6.5
SPIN_PWM_TTL
  Top 0.406: UCSP.4 77.25,62.17 77.25,60.91 79.63,58.53 R20.2
SPINDLE  (via drill 0.33)
  Top 0.406: v55.46,40.51 59.23,40.51 59.65,40.93 59.65,41.49 AVR_XMEGA192A3-AU.3 | v48.34,59.51 48.34,60.77 50.71,63.14 61.33,63.14 68.03,69.85 68.03,74.46 69.01,75.44 76.97,75.44 79.35,73.06 J6.3 | v70.27,63.84 68.45,63.84 68.03,64.26 68.03,64.68 UCS.2
  Bottom 0.406: v55.46,40.51 51.41,44.56 51.41,54.2 48.34,57.28 v48.34,59.51 | v70.27,63.84 79.35,72.92 J6.3
SPINDLE_TTL
  Top 0.406: UCS.4 67.06,62.17 67.06,59.51 68.03,58.53 R18.2
SS1
  Top 0.406: AVR_XMEGA192A3-AU.20 47.36,37.44 46.52,37.44 45.26,38.7 45.26,41.07 41.91,44.42 38.14,44.42 JP13.3
SS2
  Top 0.406: AVR_XMEGA192A3-AU.9 54.76,41.49 54.76,40.93 53.09,39.26 49.45,39.26 41.77,46.94 38.14,46.94 JP13.2
STEP_A  (via drill 0.33)
  Top 0.406: v59.51,24.87 59.51,25.98 AVR_XMEGA192A3-AU.46 | v56.16,21.51 52.81,21.51 v52.39,21.93 | v17.74,18.72 17.32,18.72 17.04,19 16.62,19 UCSA.2
  Bottom 0.406: v56.16,21.51 v59.51,24.87 | v52.39,21.93 49.17,21.93 44.28,26.82 25.84,26.82 v17.74,18.72
STEP_A_TTL
  Top 0.406: R63.2 19,20.68 15.23,20.68 14.67,20.12 13.97,20.12 UCSA.4 13.83,19.84 9.36,19.84 7.12,17.6 J3.2
STEP_X  (via drill 0.33)
  Top 0.406: v64.26,37.58 63.7,38.14 63.14,38.14 AVR_XMEGA192A3-AU.62 | v62.03,17.18 62.03,5.31 63.98,3.35 79.77,3.35 81.03,4.61 81.03,14.67 80.19,15.51 79.91,15.51 79.49,15.93 79.49,16.48 UCSX.2
  Bottom 0.406: v64.26,37.58 64.26,19.42 v62.03,17.18
STEP_X_TTL
  Top 0.406: R60.2 78.79,19 78.79,18.72 77.67,17.6 77.67,15.37 78.37,14.67 78.37,13.97 UCSX.4 78.23,13.83 78.23,10.62 74.04,6.43 J2.2
STEP_Y  (via drill 0.33)
  Top 0.406: v43.87,26.12 43.87,29.76 46.66,32.55 47.36,32.55 AVR_XMEGA192A3-AU.26 | v55.46,15.37 55.46,16.34 55.32,16.48 UCSY.2
  Bottom 0.406: v43.87,26.12 44.15,26.12 54.9,15.37 v55.46,15.37
STEP_Y_TTL
  Top 0.406: R61.2 54.62,19 53.65,18.02 53.65,15.23 54.2,14.67 54.2,13.97 UCSY.4 54.06,13.83 54.06,10.9 49.59,6.43 J5.2
STEP_Z
  Top 0.406: AVR_XMEGA192A3-AU.36 51.69,25.98 51.69,21.51 53.09,20.12 53.09,17.04 51.55,15.51 32.27,15.51 31.85,15.93 31.85,16.48 UCSZ.2
STEP_Z_TTL
  Top 0.406: R62.2 31.15,19 30.04,17.88 30.04,15.93 30.73,15.23 30.73,13.97 UCSZ.4 30.59,13.83 30.59,11.18 25.84,6.43 J4.2
TXD0  (via drill 0.33)
  Top 0.406: v48.62,38.28 47.5,38.28 AVR_XMEGA192A3-AU.19 | v44.42,40.79 34.23,40.79 33.11,41.91 J14.1 v33.02,40.01 | IC1.4 21.78,48.26 22.22,47.84 v24.22,47.83
  Bottom 0.406: v48.62,38.28 47.92,38.28 45.4,40.79 v44.42,40.79 | v24.22,47.83 25.99,47.83 26.04,40.01 v33.02,40.01
USBDM
  Top 0.406: IC1.9 19.14,44.28 17.04,44.28 15.93,45.4 12.99,45.4 D14.1 12.71,45.4 12.43,45.68 9.08,45.68 J9.2
USBDP
  Top 0.406: IC1.8 19.14,49.59 10.9,49.59 7.12,45.82 J9.3 7.4,45.82 8.66,44.56 9.22,44.56 10.2,43.59 12.85,43.59 D14.2
VCC  (via drill 0.33)
  Top 0.406: R13.1 73.2,27.38 76,27.38 R12.1 76.14,27.24 77.67,25.7 82.42,25.7 83.96,27.24 84.52,27.24 R11.1 84.8,27.24 v86.18,24.59 | v82.56,46.1 81.86,46.8 R14.1 81.72,47.5 81.72,46.8 80.75,45.82 78.37,45.82 76.69,47.5 76.14,47.5 R15.1 76,47.78 76,49.17 74.32,50.85 74.32,52.53 74.04,52.81 72.22,52.81 71.53,52.11 71.53,48.9 70.41,47.78 R16.1 70.27,47.64 68.73,47.64 64.96,51.41 R6.1 64.82,51.55 64.82,53.23 63.7,54.34 63.7,56.3 63.98,56.58 63.98,57.7 62.59,59.09 50.71,59.09 49.59,60.21 J10.2 | J7.2 93.04,24.59 93.04,25.7 99.33,31.99 99.33,50.15 93.04,56.44 J8.2 | 3.3V.TP 2.52,56.58 2.52,61.47 REGUL3.3V.4 2.65,61.61 8.66,61.61 REGUL3.3V.2 8.94,61.61 12.15,61.61 12.57,61.19 C5.+ 12.85,61.05 14.95,58.95 v15.09,58.95 | R1.2 11.6,53.92 12.71,52.81 15.65,52.81 16.76,53.92 18.16,53.92 D3.A 18.44,53.92 v20.12,52.25 | IC1.12 21.09,44.28 20.68,44.28 IC1.11 20.4,44.28 19.98,44.28 IC1.10 19.84,44.15 19.84,43.31 | 19.84,43.31 19.84,42.89 18.44,41.49 C14.1 | R17.1 81.72,37.58 78.93,37.58 R10.1 78.79,37.72 v77.53,38.98 | v22.91,48.62 22.35,49.17 22.35,49.59 IC1.3 | v46.24,33.53 47.36,33.53 AVR_XMEGA192A3-AU.25 | v50.71,29.06 50.71,26.12 AVR_XMEGA192A3-AU.35 | v58.81,27.24 58.81,26.12 AVR_XMEGA192A3-AU.45 | v50.01,39.95 50.01,41.49 AVR_XMEGA192A3-AU.15 | v61.47,31.01 63.01,31.01 AVR_XMEGA192A3-AU.53 | v61.75,37.44 63.01,37.44 AVR_XMEGA192A3-AU.61 | v16.2,40.09 14.81,38.7 14.81,35.62 D4.A | v43.59,34.78 41.91,34.78 C13.1 | v69.99,38.84 71.25,37.58 C12.1 | v19.7,43.31 19.84,43.31
  Bottom 0.406: v86.18,24.59 92.9,24.59 J7.2 | v82.56,46.1 92.9,56.44 J8.2 | v22.91,48.62 32.13,48.62 32.97,49.45 J14.4 33.11,49.31 34.23,48.2 | 46.24,36.18 46.24,34.78 | 46.24,34.78 v46.24,33.53 v50.71,29.06 52.53,27.24 v58.81,27.24 58.95,27.38 58.95,27.8 61.47,30.32 v61.47,31.01 61.75,31.29 v61.75,37.44 63.7,39.4 69.15,39.4 69.71,38.84 v69.99,38.84 70.13,38.98 73.06,38.98 73.34,39.26 76.97,39.26 77.25,38.98 v77.53,38.98 | 46.24,36.18 39.12,43.31 36.88,43.31 34.92,45.26 34.92,47.5 34.23,48.2 | v50.01,39.95 50.01,38.56 47.78,36.32 46.38,36.32 46.24,36.18 | 19.56,43.45 22.77,46.66 22.77,48.48 v22.91,48.62 | 19.56,43.45 v16.2,40.09 | 46.24,34.78 v43.59,34.78 | 34.23,48.2 46.24,60.21 49.45,60.21 J10.2 49.59,60.49 50.57,61.47 55.18,61.47 56.3,60.35 | 56.3,60.35 56.3,54.62 60.21,50.71 60.21,45.82 JPAUX.1 | v19.7,43.31 19.56,43.45 | v22.91,48.62 22.77,48.76 22.77,49.87 20.4,52.25 v20.12,52.25 15.09,57.28 v15.09,58.95 | J6.2 74.46,72.92 74.46,72.22 62.73,60.49 56.44,60.49 56.3,60.35
VIN
  Top 0.762: IC2.1 28.5,75.16 28.22,75.44 C3.2 27.94,75.72 21.23,75.72 20.95,76 C1.+ 20.68,75.86 18.3,73.48 15.93,73.48 D13.1 15.51,73.48 13.69,73.48 D13.2 13.41,73.76 12.29,74.88 6.01,74.88 J1.2
X_MAX  (via drill 0.33)
  Top 0.406: R11.2 81.86,27.38 84.52,30.04 84.52,31.01 C44.1 84.66,31.15 v95.83,31.15 | v64.4,43.73 59.51,43.73 58.12,42.33 58.12,41.63 AVR_XMEGA192A3-AU.5
  Bottom 0.406: v64.4,43.73 82.28,61.61 90.11,61.61 91.5,63.01 94.44,63.01 95.97,61.47 95.97,31.15 | 95.97,31.15 95.97,17.46 93.04,14.53 J7.4 | v95.83,31.15 95.97,31.15
X_MIN  (via drill 0.33)
  Top 0.406: v63.28,42.61 59.23,42.61 58.95,42.33 58.95,41.63 AVR_XMEGA192A3-AU.4 | C43.1 78.79,41.21 78.51,41.21 75.58,38.28 R10.2 76,37.58 74.74,38.84 v74.74,40.51 74.88,40.65 74.88,42.33 75.72,43.17 84.94,43.17 86.47,41.63 v86.47,39.4
  Bottom 0.406: v63.28,42.61 72.64,42.61 v74.74,40.51 | v86.47,39.4 95.42,30.45 95.42,24.03 93.04,21.65 93.04,19.56 J7.3
Y_MAX  (via drill 0.33)
  Top 0.406: v49.31,24.87 49.31,25.98 AVR_XMEGA192A3-AU.33 | R13.2 70.41,27.24 70.55,27.1 v70.55,20.95 70.69,20.82 v76.69,20.82 | v71.81,31.01 70.41,31.01 C46.1
  Bottom 0.406: v49.31,24.87 50.57,24.87 54.2,21.23 54.2,19.56 58.12,15.65 64.96,15.65 70.27,20.95 v70.55,20.95 78.23,28.64 78.23,30.45 77.67,31.01 v71.81,31.01 | v76.69,20.82 92.9,4.61 J7.6
Y_MIN  (via drill 0.33)
  Top 0.406: v49.31,28.5 48.76,27.94 47.5,27.94 AVR_XMEGA192A3-AU.32 | v63.56,26.96 67.75,26.96 69.43,28.64 77.53,28.64 78.79,27.38 R12.2 | v80.19,30.04 79.21,31.01 78.93,31.01 C45.1 | v80.19,28.64 78.93,27.38 R12.2 | v80.19,26.4 79.21,27.38 R12.2
  Bottom 0.406: v49.31,28.5 50.15,28.5 54.48,24.17 57.98,24.17 58.81,25.01 58.81,25.29 60.49,26.96 v63.56,26.96 | v80.19,28.64 v80.19,30.04 | v80.19,26.4 82.28,24.31 82.28,22.21 92.9,11.6 92.9,9.5 J7.5
Z_MAX  (via drill 0.33)
  Top 0.406: C48.1 78.93,51.41 78.93,47.64 R15.2 79.07,47.5 80.05,46.52 v80.19,46.52 | v57.56,24.87 57.28,25.15 57.28,25.98 AVR_XMEGA192A3-AU.43 | v83.96,39.67 83.26,38.98 v82.42,38.98 82.28,39.12 81.72,39.12 v80.19,40.65
  Bottom 0.406: v57.56,24.87 63.56,30.87 63.56,38 63.98,38.42 69.29,38.42 69.57,38.14 73.06,38.14 73.62,38.7 76.69,38.7 77.11,38.28 81.72,38.28 v82.42,38.98 | v83.96,39.67 85.64,39.67 92.34,46.38 92.9,46.38 J8.4 | v80.19,40.65 v80.19,46.52
Z_MIN  (via drill 0.33)
  Top 0.406: v56.58,29.76 56.58,26.12 AVR_XMEGA192A3-AU.42 | v67.33,45.54 v56.58,34.78 | v83.26,51.27 84.38,51.27 84.52,51.41 C47.1 | R14.2 84.52,47.64 84.52,51.13 C47.1 | J8.3 92.9,51.55 84.66,51.55 C47.1
  Bottom 0.406: v56.58,34.78 v56.58,29.76 | v67.33,45.54 77.53,45.54 v83.26,51.27

### Text on the board
tPlace: CncBooster v1.1
tNames: +Vmot | 30V max | GND | GND | 3.3V | SPINDIR | SPINPWM | SPINDLE | COOLANT | GND | 3.3V | Z_MIN | Z_MAX | A_MIN | A_MAX | ENABLE_A | GND | DIR_A | 3.3V | STEP_A | X_MIN | GND | X_MAX | ENABLE_Z | DIR_Z | STEP_Z | GND | ENABLE_Y | DIR_Y | STEP_Y | GND | ENABLE_X | DIR_X | STEP_X | GND | Y_MIN | Y_MAX